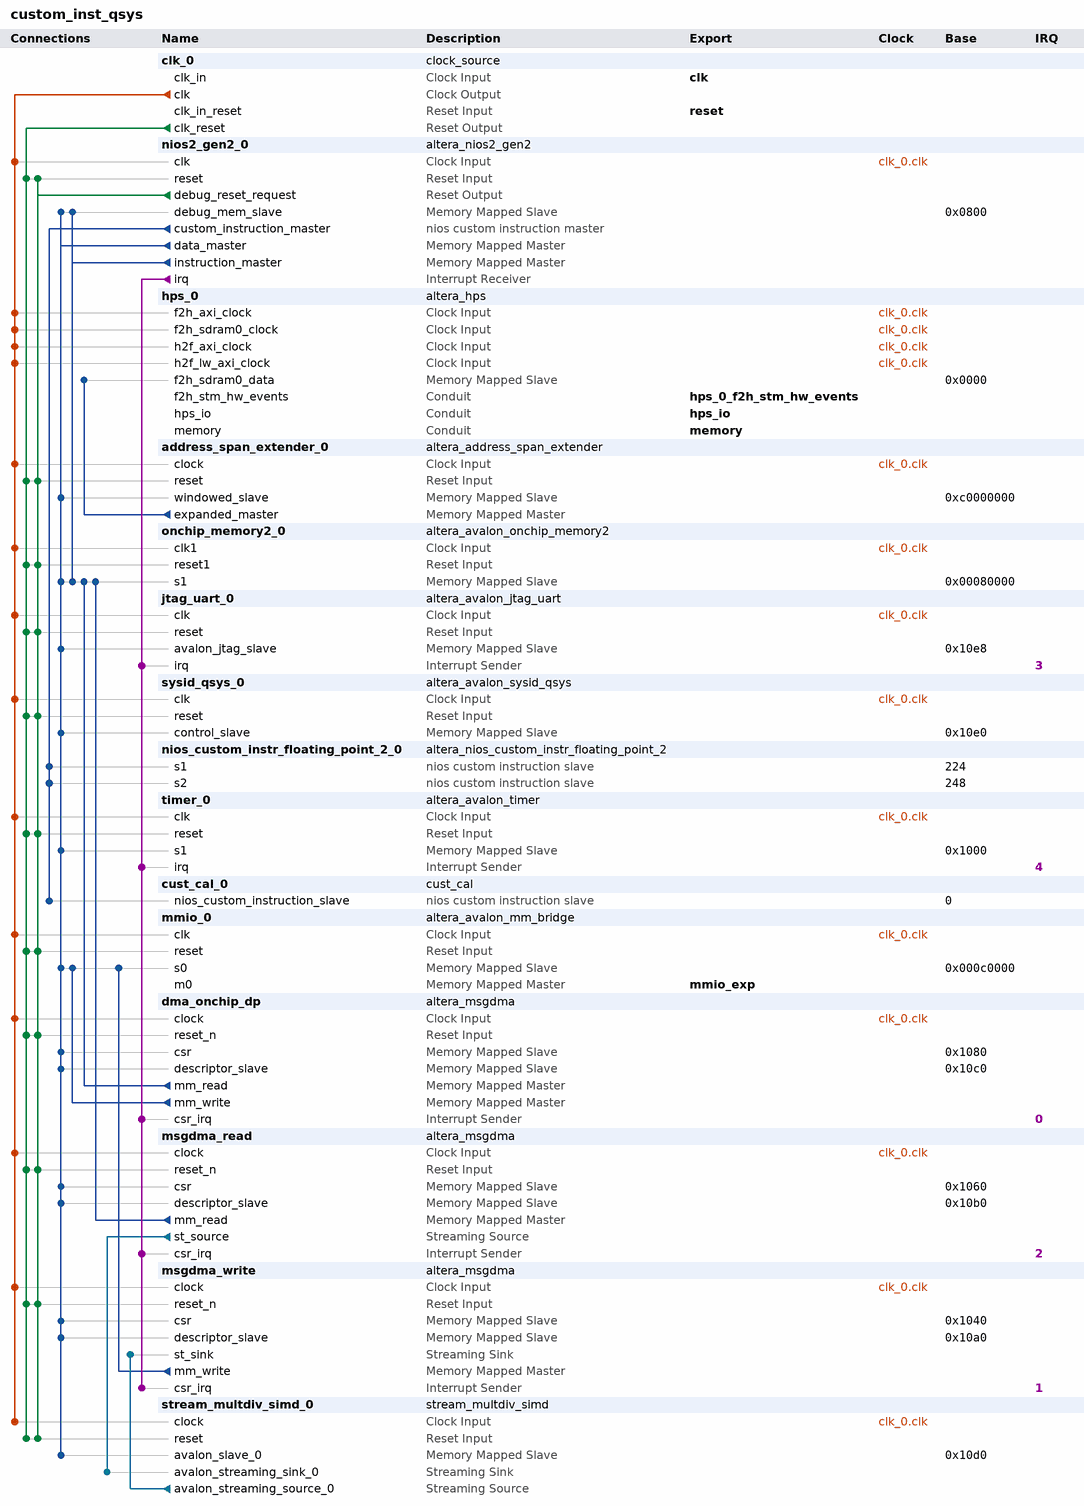
[diagram p0: system contents]
# Platform Designer (Qsys) system custom_inst_qsys, Cyclone V 5CSEBA6U23I7
# Parameters at their usual value, and those the tool derives, are not listed.
package require -exact qsys 20.1
create_system custom_inst_qsys
set_project_property DEVICE_FAMILY {Cyclone V}
set_project_property DEVICE 5CSEBA6U23I7

add_instance clk_0 clock_source 20.1
set_instance_parameter_value clk_0 clockFrequency 50000000

add_instance nios2_gen2_0 altera_nios2_gen2 20.1
set_instance_parameter_value nios2_gen2_0 dcache_size 0
set_instance_parameter_value nios2_gen2_0 dividerType srt2
set_instance_parameter_value nios2_gen2_0 exceptionSlave onchip_memory2_0.s1
set_instance_parameter_value nios2_gen2_0 icache_size 0
set_instance_parameter_value nios2_gen2_0 impl Tiny
set_instance_parameter_value nios2_gen2_0 resetSlave onchip_memory2_0.s1

add_instance hps_0 altera_hps 20.1
set_instance_parameter_value hps_0 EMAC1_Mode RGMII
set_instance_parameter_value hps_0 EMAC1_PinMuxing {HPS I/O Set 0}
set_instance_parameter_value hps_0 F2SCLK_COLDRST_Enable false
set_instance_parameter_value hps_0 F2SCLK_DBGRST_Enable false
set_instance_parameter_value hps_0 F2SCLK_WARMRST_Enable false
set_instance_parameter_value hps_0 F2SDRAM_Type {Avalon-MM Bidirectional}
set_instance_parameter_value hps_0 F2SDRAM_Width 32
set_instance_parameter_value hps_0 F2SINTERRUPT_Enable false
set_instance_parameter_value hps_0 F2S_Width 2
set_instance_parameter_value hps_0 FPGA_PERIPHERAL_OUTPUT_CLOCK_FREQ_EMAC0_GTX_CLK 125
set_instance_parameter_value hps_0 FPGA_PERIPHERAL_OUTPUT_CLOCK_FREQ_EMAC0_MD_CLK 2.5
set_instance_parameter_value hps_0 FPGA_PERIPHERAL_OUTPUT_CLOCK_FREQ_EMAC1_GTX_CLK 125
set_instance_parameter_value hps_0 FPGA_PERIPHERAL_OUTPUT_CLOCK_FREQ_EMAC1_MD_CLK 2.5
set_instance_parameter_value hps_0 HPS_PROTOCOL DDR3
set_instance_parameter_value hps_0 I2C0_Mode I2C
set_instance_parameter_value hps_0 I2C0_PinMuxing {HPS I/O Set 0}
set_instance_parameter_value hps_0 I2C1_Mode I2C
set_instance_parameter_value hps_0 I2C1_PinMuxing {HPS I/O Set 0}
set_instance_parameter_value hps_0 LWH2F_Enable true
set_instance_parameter_value hps_0 MEM_BANKADDR_WIDTH 3
set_instance_parameter_value hps_0 MEM_CLK_FREQ 400.0
set_instance_parameter_value hps_0 MEM_COL_ADDR_WIDTH 10
set_instance_parameter_value hps_0 MEM_DQ_WIDTH 32
set_instance_parameter_value hps_0 MEM_DRV_STR RZQ/6
set_instance_parameter_value hps_0 MEM_ROW_ADDR_WIDTH 15
set_instance_parameter_value hps_0 MEM_RTT_NOM RZQ/6
set_instance_parameter_value hps_0 MEM_RTT_WR {Dynamic ODT off}
set_instance_parameter_value hps_0 MEM_TCL 7
set_instance_parameter_value hps_0 MEM_TFAW_NS 37.5
set_instance_parameter_value hps_0 MEM_TRAS_NS 35.0
set_instance_parameter_value hps_0 MEM_TRCD_NS 13.75
set_instance_parameter_value hps_0 MEM_TRFC_NS 300.0
set_instance_parameter_value hps_0 MEM_TRP_NS 13.75
set_instance_parameter_value hps_0 MEM_VENDOR Other
set_instance_parameter_value hps_0 MEM_WTCL 7
set_instance_parameter_value hps_0 QSPI_Mode N/A
set_instance_parameter_value hps_0 QSPI_PinMuxing Unused
set_instance_parameter_value hps_0 REF_CLK_FREQ 25.0
set_instance_parameter_value hps_0 S2FCLK_USER2CLK 5
set_instance_parameter_value hps_0 S2F_Width 2
set_instance_parameter_value hps_0 SDIO_Mode {4-bit Data}
set_instance_parameter_value hps_0 SDIO_PinMuxing {HPS I/O Set 0}
set_instance_parameter_value hps_0 SPIM1_Mode {Single Slave Select}
set_instance_parameter_value hps_0 SPIM1_PinMuxing {HPS I/O Set 0}
set_instance_parameter_value hps_0 STM_Enable true
set_instance_parameter_value hps_0 TIMING_BOARD_AC_SKEW 0.02
set_instance_parameter_value hps_0 TIMING_BOARD_AC_TO_CK_SKEW 0.0
set_instance_parameter_value hps_0 TIMING_BOARD_DQ_TO_DQS_SKEW 0.0
set_instance_parameter_value hps_0 TIMING_BOARD_MAX_CK_DELAY 0.6
set_instance_parameter_value hps_0 TIMING_BOARD_MAX_DQS_DELAY 0.6
set_instance_parameter_value hps_0 TIMING_BOARD_SKEW_BETWEEN_DQS 0.02
set_instance_parameter_value hps_0 TIMING_BOARD_SKEW_CKDQS_DIMM_MAX 0.01
set_instance_parameter_value hps_0 TIMING_BOARD_SKEW_CKDQS_DIMM_MIN -0.01
set_instance_parameter_value hps_0 TIMING_BOARD_SKEW_WITHIN_DQS 0.02
set_instance_parameter_value hps_0 TIMING_TDH 125
set_instance_parameter_value hps_0 TIMING_TDQSCK 400
set_instance_parameter_value hps_0 TIMING_TDQSQ 120
set_instance_parameter_value hps_0 TIMING_TDS 50
set_instance_parameter_value hps_0 TIMING_TIH 250
set_instance_parameter_value hps_0 TIMING_TIS 175
set_instance_parameter_value hps_0 TIMING_TQSH 0.38
set_instance_parameter_value hps_0 UART0_Mode {No Flow Control}
set_instance_parameter_value hps_0 UART0_PinMuxing {HPS I/O Set 0}
set_instance_parameter_value hps_0 USB1_Mode SDR
set_instance_parameter_value hps_0 USB1_PinMuxing {HPS I/O Set 0}
set_instance_parameter_value hps_0 desired_cfg_clk_mhz 100.0
set_instance_parameter_value hps_0 desired_qspi_clk_mhz 400.0

add_instance address_span_extender_0 altera_address_span_extender 20.1
set_instance_parameter_value address_span_extender_0 BURSTCOUNT_WIDTH 1
set_instance_parameter_value address_span_extender_0 DATA_WIDTH 32
set_instance_parameter_value address_span_extender_0 ENABLE_SLAVE_PORT false
set_instance_parameter_value address_span_extender_0 MASTER_ADDRESS_DEF 805306368
set_instance_parameter_value address_span_extender_0 MAX_PENDING_READS 1
set_instance_parameter_value address_span_extender_0 SLAVE_ADDRESS_WIDTH 26

add_instance onchip_memory2_0 altera_avalon_onchip_memory2 20.1
set_instance_parameter_value onchip_memory2_0 dataWidth 32
set_instance_parameter_value onchip_memory2_0 dualPort false
set_instance_parameter_value onchip_memory2_0 initMemContent true
set_instance_parameter_value onchip_memory2_0 initializationFileName onchip_mem.hex
set_instance_parameter_value onchip_memory2_0 memorySize 262144

add_instance jtag_uart_0 altera_avalon_jtag_uart 20.1
set_instance_parameter_value jtag_uart_0 simInteractiveOptions NO_INTERACTIVE_WINDOWS

add_instance sysid_qsys_0 altera_avalon_sysid_qsys 20.1
set_instance_parameter_value sysid_qsys_0 id 0

add_instance nios_custom_instr_floating_point_2_0 altera_nios_custom_instr_floating_point_2 20.1
set_instance_parameter_value nios_custom_instr_floating_point_2_0 arithmetic_present true
set_instance_parameter_value nios_custom_instr_floating_point_2_0 comparison_present false
set_instance_parameter_value nios_custom_instr_floating_point_2_0 conversion_present false
set_instance_parameter_value nios_custom_instr_floating_point_2_0 root_present false

add_instance timer_0 altera_avalon_timer 20.1
set_instance_parameter_value timer_0 counterSize 64
set_instance_parameter_value timer_0 period 10
set_instance_parameter_value timer_0 periodUnits SEC

add_instance cust_cal_0 cust_cal 1.0

add_instance mmio_0 altera_avalon_mm_bridge 20.1
set_instance_parameter_value mmio_0 ADDRESS_UNITS WORDS
set_instance_parameter_value mmio_0 ADDRESS_WIDTH 8
set_instance_parameter_value mmio_0 DATA_WIDTH 32
set_instance_parameter_value mmio_0 MAX_PENDING_RESPONSES 4
set_instance_parameter_value mmio_0 USE_AUTO_ADDRESS_WIDTH 0

add_instance dma_onchip_dp altera_msgdma 20.1
set_instance_parameter_value dma_onchip_dp BURST_ENABLE 0
set_instance_parameter_value dma_onchip_dp DATA_FIFO_DEPTH 32
set_instance_parameter_value dma_onchip_dp DATA_WIDTH 32
set_instance_parameter_value dma_onchip_dp DESCRIPTOR_FIFO_DEPTH 128
set_instance_parameter_value dma_onchip_dp ENHANCED_FEATURES 0
set_instance_parameter_value dma_onchip_dp ERROR_ENABLE 0
set_instance_parameter_value dma_onchip_dp MAX_BURST_COUNT 2
set_instance_parameter_value dma_onchip_dp MAX_BYTE 1024
set_instance_parameter_value dma_onchip_dp MODE 0
set_instance_parameter_value dma_onchip_dp PACKET_ENABLE 0
set_instance_parameter_value dma_onchip_dp TRANSFER_TYPE {Aligned Accesses}

add_instance msgdma_read altera_msgdma 20.1
set_instance_parameter_value msgdma_read BURST_ENABLE 0
set_instance_parameter_value msgdma_read DATA_FIFO_DEPTH 64
set_instance_parameter_value msgdma_read DATA_WIDTH 128
set_instance_parameter_value msgdma_read DESCRIPTOR_FIFO_DEPTH 128
set_instance_parameter_value msgdma_read ENHANCED_FEATURES 0
set_instance_parameter_value msgdma_read ERROR_ENABLE 0
set_instance_parameter_value msgdma_read MAX_BURST_COUNT 2
set_instance_parameter_value msgdma_read MAX_BYTE 4096
set_instance_parameter_value msgdma_read MODE 1
set_instance_parameter_value msgdma_read PACKET_ENABLE 0
set_instance_parameter_value msgdma_read TRANSFER_TYPE {Aligned Accesses}

add_instance msgdma_write altera_msgdma 20.1
set_instance_parameter_value msgdma_write BURST_ENABLE 0
set_instance_parameter_value msgdma_write DATA_FIFO_DEPTH 64
set_instance_parameter_value msgdma_write DATA_WIDTH 128
set_instance_parameter_value msgdma_write DESCRIPTOR_FIFO_DEPTH 128
set_instance_parameter_value msgdma_write ENHANCED_FEATURES 0
set_instance_parameter_value msgdma_write ERROR_ENABLE 0
set_instance_parameter_value msgdma_write MAX_BURST_COUNT 2
set_instance_parameter_value msgdma_write MAX_BYTE 4096
set_instance_parameter_value msgdma_write MODE 2
set_instance_parameter_value msgdma_write PACKET_ENABLE 0
set_instance_parameter_value msgdma_write TRANSFER_TYPE {Aligned Accesses}

add_instance stream_multdiv_simd_0 stream_multdiv_simd 1.0
set_instance_parameter_value stream_multdiv_simd_0 LANES 4
set_instance_parameter_value stream_multdiv_simd_0 STAGES 3

# connections
add_connection clk_0.clk address_span_extender_0.clock clock
add_connection clk_0.clk dma_onchip_dp.clock clock
add_connection clk_0.clk hps_0.f2h_axi_clock clock
add_connection clk_0.clk hps_0.f2h_sdram0_clock clock
add_connection clk_0.clk hps_0.h2f_axi_clock clock
add_connection clk_0.clk hps_0.h2f_lw_axi_clock clock
add_connection clk_0.clk jtag_uart_0.clk clock
add_connection clk_0.clk mmio_0.clk clock
add_connection clk_0.clk msgdma_read.clock clock
add_connection clk_0.clk msgdma_write.clock clock
add_connection clk_0.clk nios2_gen2_0.clk clock
add_connection clk_0.clk onchip_memory2_0.clk1 clock
add_connection clk_0.clk stream_multdiv_simd_0.clock clock
add_connection clk_0.clk sysid_qsys_0.clk clock
add_connection clk_0.clk timer_0.clk clock
add_connection clk_0.clk_reset address_span_extender_0.reset reset
add_connection clk_0.clk_reset dma_onchip_dp.reset_n reset
add_connection clk_0.clk_reset jtag_uart_0.reset reset
add_connection clk_0.clk_reset mmio_0.reset reset
add_connection clk_0.clk_reset msgdma_read.reset_n reset
add_connection clk_0.clk_reset msgdma_write.reset_n reset
add_connection clk_0.clk_reset nios2_gen2_0.reset reset
add_connection clk_0.clk_reset onchip_memory2_0.reset1 reset
add_connection clk_0.clk_reset stream_multdiv_simd_0.reset reset
add_connection clk_0.clk_reset sysid_qsys_0.reset reset
add_connection clk_0.clk_reset timer_0.reset reset
add_connection nios2_gen2_0.debug_reset_request address_span_extender_0.reset reset
add_connection nios2_gen2_0.debug_reset_request dma_onchip_dp.reset_n reset
add_connection nios2_gen2_0.debug_reset_request jtag_uart_0.reset reset
add_connection nios2_gen2_0.debug_reset_request mmio_0.reset reset
add_connection nios2_gen2_0.debug_reset_request msgdma_read.reset_n reset
add_connection nios2_gen2_0.debug_reset_request msgdma_write.reset_n reset
add_connection nios2_gen2_0.debug_reset_request nios2_gen2_0.reset reset
add_connection nios2_gen2_0.debug_reset_request onchip_memory2_0.reset1 reset
add_connection nios2_gen2_0.debug_reset_request stream_multdiv_simd_0.reset reset
add_connection nios2_gen2_0.debug_reset_request sysid_qsys_0.reset reset
add_connection nios2_gen2_0.debug_reset_request timer_0.reset reset
add_connection address_span_extender_0.expanded_master hps_0.f2h_sdram0_data avalon
set_connection_parameter_value address_span_extender_0.expanded_master/hps_0.f2h_sdram0_data baseAddress 0x0000
add_connection dma_onchip_dp.mm_read onchip_memory2_0.s1 avalon
set_connection_parameter_value dma_onchip_dp.mm_read/onchip_memory2_0.s1 baseAddress 0x00080000
add_connection dma_onchip_dp.mm_write mmio_0.s0 avalon
set_connection_parameter_value dma_onchip_dp.mm_write/mmio_0.s0 baseAddress 0x000c0000
add_connection msgdma_read.mm_read onchip_memory2_0.s1 avalon
set_connection_parameter_value msgdma_read.mm_read/onchip_memory2_0.s1 baseAddress 0x00080000
add_connection msgdma_write.mm_write mmio_0.s0 avalon
set_connection_parameter_value msgdma_write.mm_write/mmio_0.s0 baseAddress 0x000c0000
add_connection nios2_gen2_0.data_master address_span_extender_0.windowed_slave avalon
set_connection_parameter_value nios2_gen2_0.data_master/address_span_extender_0.windowed_slave baseAddress 0xc0000000
add_connection nios2_gen2_0.data_master dma_onchip_dp.csr avalon
set_connection_parameter_value nios2_gen2_0.data_master/dma_onchip_dp.csr baseAddress 0x1080
add_connection nios2_gen2_0.data_master dma_onchip_dp.descriptor_slave avalon
set_connection_parameter_value nios2_gen2_0.data_master/dma_onchip_dp.descriptor_slave baseAddress 0x10c0
add_connection nios2_gen2_0.data_master jtag_uart_0.avalon_jtag_slave avalon
set_connection_parameter_value nios2_gen2_0.data_master/jtag_uart_0.avalon_jtag_slave baseAddress 0x10e8
add_connection nios2_gen2_0.data_master mmio_0.s0 avalon
set_connection_parameter_value nios2_gen2_0.data_master/mmio_0.s0 baseAddress 0x000c0000
add_connection nios2_gen2_0.data_master msgdma_read.csr avalon
set_connection_parameter_value nios2_gen2_0.data_master/msgdma_read.csr baseAddress 0x1060
add_connection nios2_gen2_0.data_master msgdma_read.descriptor_slave avalon
set_connection_parameter_value nios2_gen2_0.data_master/msgdma_read.descriptor_slave baseAddress 0x10b0
add_connection nios2_gen2_0.data_master msgdma_write.csr avalon
set_connection_parameter_value nios2_gen2_0.data_master/msgdma_write.csr baseAddress 0x1040
add_connection nios2_gen2_0.data_master msgdma_write.descriptor_slave avalon
set_connection_parameter_value nios2_gen2_0.data_master/msgdma_write.descriptor_slave baseAddress 0x10a0
add_connection nios2_gen2_0.data_master nios2_gen2_0.debug_mem_slave avalon
set_connection_parameter_value nios2_gen2_0.data_master/nios2_gen2_0.debug_mem_slave baseAddress 0x0800
add_connection nios2_gen2_0.data_master onchip_memory2_0.s1 avalon
set_connection_parameter_value nios2_gen2_0.data_master/onchip_memory2_0.s1 baseAddress 0x00080000
add_connection nios2_gen2_0.data_master stream_multdiv_simd_0.avalon_slave_0 avalon
set_connection_parameter_value nios2_gen2_0.data_master/stream_multdiv_simd_0.avalon_slave_0 baseAddress 0x10d0
add_connection nios2_gen2_0.data_master sysid_qsys_0.control_slave avalon
set_connection_parameter_value nios2_gen2_0.data_master/sysid_qsys_0.control_slave baseAddress 0x10e0
add_connection nios2_gen2_0.data_master timer_0.s1 avalon
set_connection_parameter_value nios2_gen2_0.data_master/timer_0.s1 baseAddress 0x1000
add_connection nios2_gen2_0.instruction_master nios2_gen2_0.debug_mem_slave avalon
set_connection_parameter_value nios2_gen2_0.instruction_master/nios2_gen2_0.debug_mem_slave baseAddress 0x0800
add_connection nios2_gen2_0.instruction_master onchip_memory2_0.s1 avalon
set_connection_parameter_value nios2_gen2_0.instruction_master/onchip_memory2_0.s1 baseAddress 0x00080000
add_connection msgdma_read.st_source stream_multdiv_simd_0.avalon_streaming_sink_0 avalon_streaming
add_connection stream_multdiv_simd_0.avalon_streaming_source_0 msgdma_write.st_sink avalon_streaming
add_connection nios2_gen2_0.irq dma_onchip_dp.csr_irq interrupt
set_connection_parameter_value nios2_gen2_0.irq/dma_onchip_dp.csr_irq irqNumber 0
add_connection nios2_gen2_0.irq jtag_uart_0.irq interrupt
set_connection_parameter_value nios2_gen2_0.irq/jtag_uart_0.irq irqNumber 3
add_connection nios2_gen2_0.irq msgdma_read.csr_irq interrupt
set_connection_parameter_value nios2_gen2_0.irq/msgdma_read.csr_irq irqNumber 2
add_connection nios2_gen2_0.irq msgdma_write.csr_irq interrupt
set_connection_parameter_value nios2_gen2_0.irq/msgdma_write.csr_irq irqNumber 1
add_connection nios2_gen2_0.irq timer_0.irq interrupt
set_connection_parameter_value nios2_gen2_0.irq/timer_0.irq irqNumber 4
add_connection nios2_gen2_0.custom_instruction_master cust_cal_0.nios_custom_instruction_slave nios_custom_instruction
set_connection_parameter_value nios2_gen2_0.custom_instruction_master/cust_cal_0.nios_custom_instruction_slave CIName cust_cal_0
set_connection_parameter_value nios2_gen2_0.custom_instruction_master/cust_cal_0.nios_custom_instruction_slave baseAddress 0
add_connection nios2_gen2_0.custom_instruction_master nios_custom_instr_floating_point_2_0.s1 nios_custom_instruction
set_connection_parameter_value nios2_gen2_0.custom_instruction_master/nios_custom_instr_floating_point_2_0.s1 CIName nios_custom_instr_floating_point_2_0
set_connection_parameter_value nios2_gen2_0.custom_instruction_master/nios_custom_instr_floating_point_2_0.s1 baseAddress 224
add_connection nios2_gen2_0.custom_instruction_master nios_custom_instr_floating_point_2_0.s2 nios_custom_instruction
set_connection_parameter_value nios2_gen2_0.custom_instruction_master/nios_custom_instr_floating_point_2_0.s2 CIName nios_custom_instr_floating_point_2_0_1
set_connection_parameter_value nios2_gen2_0.custom_instruction_master/nios_custom_instr_floating_point_2_0.s2 baseAddress 248

# exported interfaces
add_interface clk clock sink
set_interface_property clk EXPORT_OF clk_0.clk_in
add_interface hps_0_f2h_stm_hw_events conduit end
set_interface_property hps_0_f2h_stm_hw_events EXPORT_OF hps_0.f2h_stm_hw_events
add_interface hps_io conduit end
set_interface_property hps_io EXPORT_OF hps_0.hps_io
add_interface memory conduit end
set_interface_property memory EXPORT_OF hps_0.memory
add_interface mmio_exp avalon master
set_interface_property mmio_exp EXPORT_OF mmio_0.m0
add_interface reset reset sink
set_interface_property reset EXPORT_OF clk_0.clk_in_reset

set_interconnect_requirement {$system} qsys_mm.clockCrossingAdapter HANDSHAKE
set_interconnect_requirement {$system} qsys_mm.enableEccProtection FALSE
set_interconnect_requirement {$system} qsys_mm.insertDefaultSlave FALSE
set_interconnect_requirement {$system} qsys_mm.maxAdditionalLatency 1

save_system custom_inst_qsys.qsys
